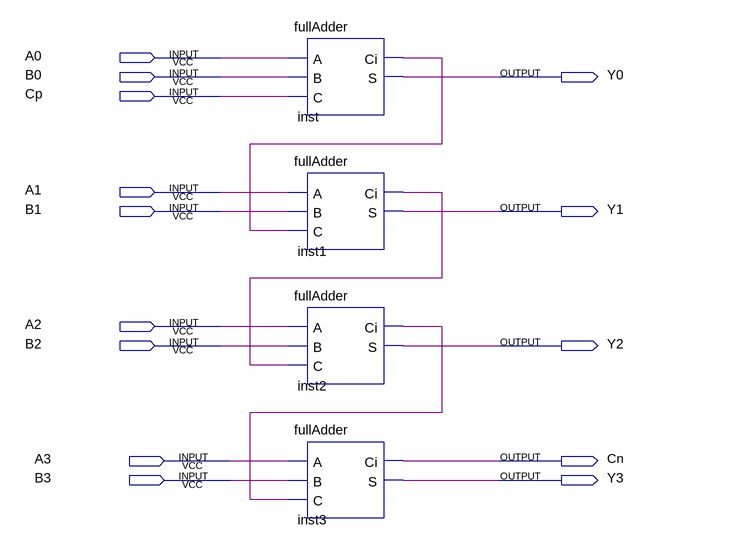
[diagram p0: schematic sheet]
// Quartus schematic fullAdder_4bit.bdf as structural Verilog: 4 symbols, 14 pins
module fullAdder_4bit (
  input  A0,
  input  B0,
  input  Cp,
  input  A1,
  input  B1,
  input  A2,
  input  B2,
  input  A3,
  input  B3,
  output Y0,
  output Y1,
  output Y2,
  output Cn,
  output Y3
);

  wire inst1_ci, inst2_ci, inst_ci;

  fullAdder inst (.A(A0), .B(B0), .C(Cp), .Ci(inst_ci), .S(Y0));
  fullAdder inst1 (.A(A1), .B(B1), .C(inst_ci), .Ci(inst1_ci), .S(Y1));
  fullAdder inst2 (.A(A2), .B(B2), .C(inst1_ci), .Ci(inst2_ci), .S(Y2));
  fullAdder inst3 (.A(A3), .B(B3), .C(inst2_ci), .Ci(Cn), .S(Y3));
endmodule
